# Altium schematic sheet MCU_A.SchDoc
size A3; SheetNumber: 1; SheetTotal: 5
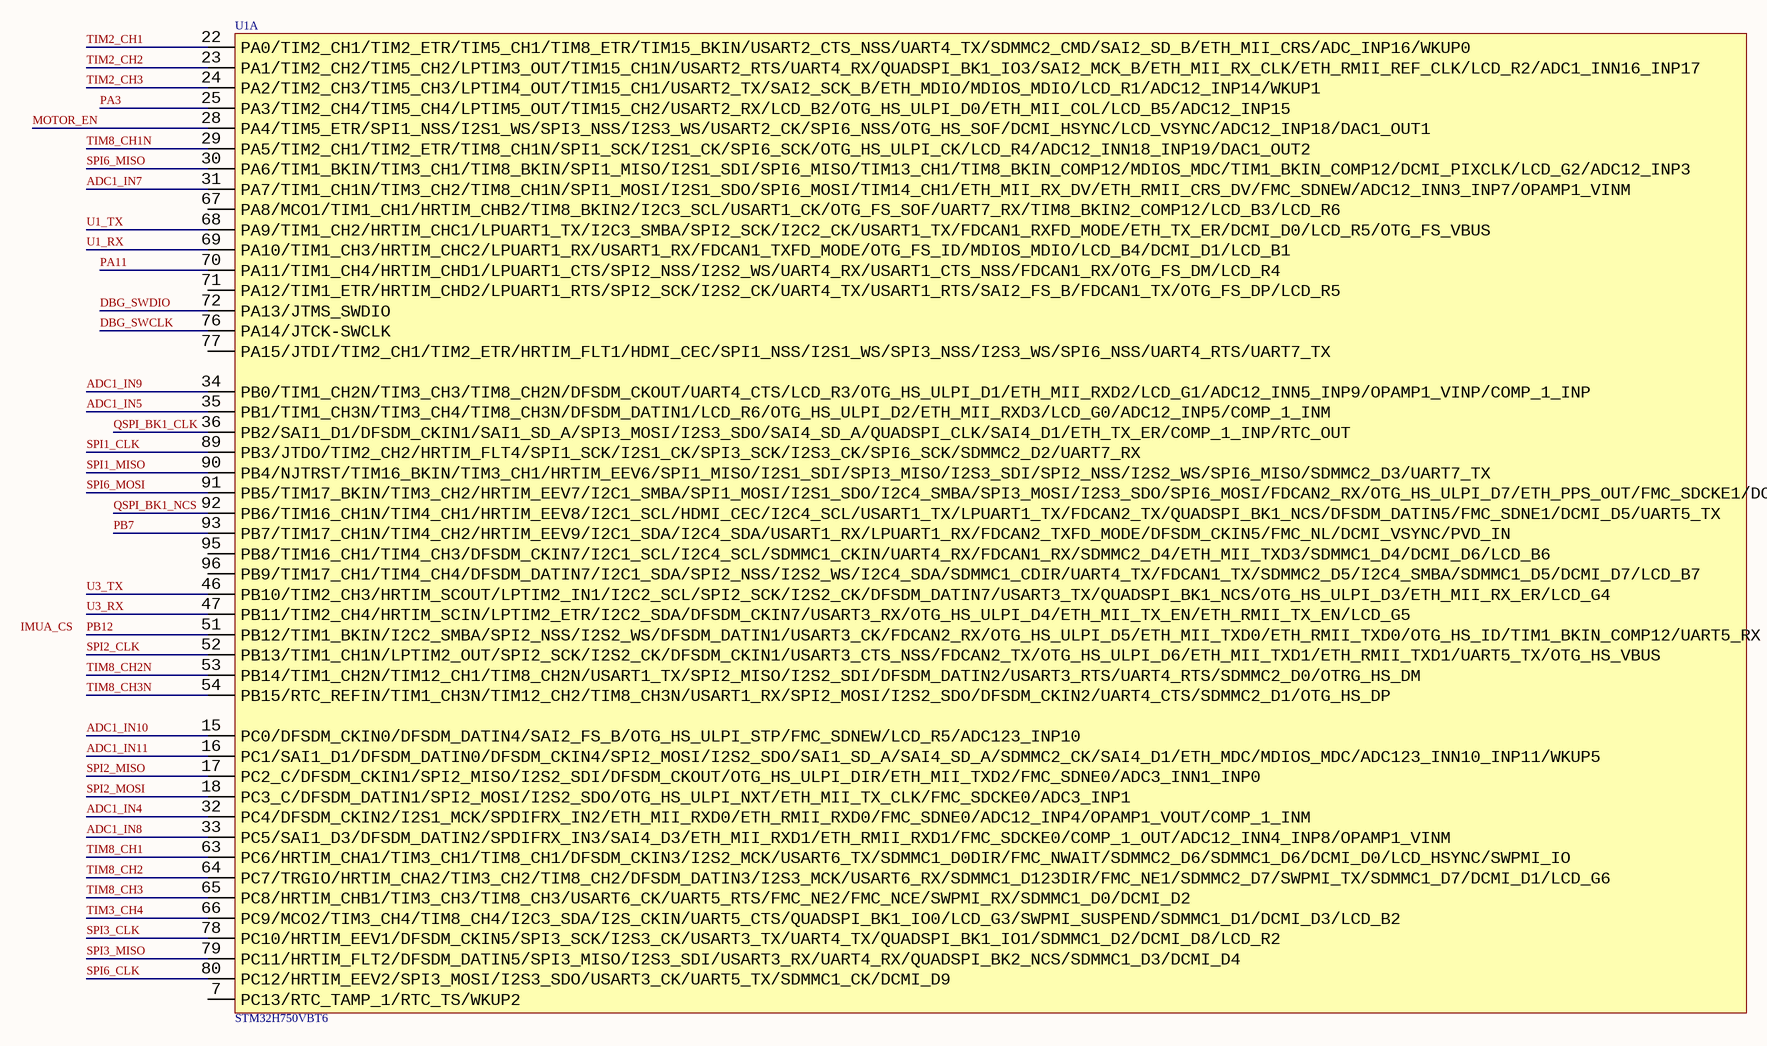
[diagram p0: MCU_A.SchDoc]

## Parts
U1  STM32H750VBT6  [LQFP100 14x14_L]  (part A of 3)

## Nets
ADC1_IN4: U1.32(PC4/DFSDM_CKIN2/I2S1_MCK/SPDIFRX_IN2/ETH_MII_RXD0/ETH_RMII_RXD0/FMC_SDNE0/ADC12_INP4/OPAMP1_VOUT/COMP_1_INM)
ADC1_IN5: U1.35(PB1/TIM1_CH3N/TIM3_CH4/TIM8_CH3N/DFSDM_DATIN1/LCD_R6/OTG_HS_ULPI_D2/ETH_MII_RXD3/LCD_G0/ADC12_INP5/COMP_1_INM)
ADC1_IN7: U1.31(PA7/TIM1_CH1N/TIM3_CH2/TIM8_CH1N/SPI1_MOSI/I2S1_SDO/SPI6_MOSI/TIM14_CH1/ETH_MII_RX_DV/ETH_RMII_CRS_DV/FMC_SDNEW/ADC12_INN3_INP7/OPAMP1_VINM)
ADC1_IN8: U1.33(PC5/SAI1_D3/DFSDM_DATIN2/SPDIFRX_IN3/SAI4_D3/ETH_MII_RXD1/ETH_RMII_RXD1/FMC_SDCKE0/COMP_1_OUT/ADC12_INN4_INP8/OPAMP1_VINM)
ADC1_IN9: U1.34(PB0/TIM1_CH2N/TIM3_CH3/TIM8_CH2N/DFSDM_CKOUT/UART4_CTS/LCD_R3/OTG_HS_ULPI_D1/ETH_MII_RXD2/LCD_G1/ADC12_INN5_INP9/OPAMP1_VINP/COMP_1_INP)
ADC1_IN10: U1.15(PC0/DFSDM_CKIN0/DFSDM_DATIN4/SAI2_FS_B/OTG_HS_ULPI_STP/FMC_SDNEW/LCD_R5/ADC123_INP10)
ADC1_IN11: U1.16(PC1/SAI1_D1/DFSDM_DATIN0/DFSDM_CKIN4/SPI2_MOSI/I2S2_SDO/SAI1_SD_A/SAI4_SD_A/SDMMC2_CK/SAI4_D1/ETH_MDC/MDIOS_MDC/ADC123_INN10_INP11/WKUP5)
DBG_SWCLK: U1.76(PA14/JTCK-SWCLK)
DBG_SWDIO: U1.72(PA13/JTMS_SWDIO)
MOTOR_EN: U1.28(PA4/TIM5_ETR/SPI1_NSS/I2S1_WS/SPI3_NSS/I2S3_WS/USART2_CK/SPI6_NSS/OTG_HS_SOF/DCMI_HSYNC/LCD_VSYNC/ADC12_INP18/DAC1_OUT1)
PA3: U1.25(PA3/TIM2_CH4/TIM5_CH4/LPTIM5_OUT/TIM15_CH2/USART2_RX/LCD_B2/OTG_HS_ULPI_D0/ETH_MII_COL/LCD_B5/ADC12_INP15)
PA11: U1.70(PA11/TIM1_CH4/HRTIM_CHD1/LPUART1_CTS/SPI2_NSS/I2S2_WS/UART4_RX/USART1_CTS_NSS/FDCAN1_RX/OTG_FS_DM/LCD_R4)
PB7: U1.93(PB7/TIM17_CH1N/TIM4_CH2/HRTIM_EEV9/I2C1_SDA/I2C4_SDA/USART1_RX/LPUART1_RX/FDCAN2_TXFD_MODE/DFSDM_CKIN5/FMC_NL/DCMI_VSYNC/PVD_IN)
PB12: U1.51(PB12/TIM1_BKIN/I2C2_SMBA/SPI2_NSS/I2S2_WS/DFSDM_DATIN1/USART3_CK/FDCAN2_RX/OTG_HS_ULPI_D5/ETH_MII_TXD0/ETH_RMII_TXD0/OTG_HS_ID/TIM1_BKIN_COMP12/UART5_RX)
QSPI_BK1_CLK: U1.36(PB2/SAI1_D1/DFSDM_CKIN1/SAI1_SD_A/SPI3_MOSI/I2S3_SDO/SAI4_SD_A/QUADSPI_CLK/SAI4_D1/ETH_TX_ER/COMP_1_INP/RTC_OUT)
QSPI_BK1_NCS: U1.92(PB6/TIM16_CH1N/TIM4_CH1/HRTIM_EEV8/I2C1_SCL/HDMI_CEC/I2C4_SCL/USART1_TX/LPUART1_TX/FDCAN2_TX/QUADSPI_BK1_NCS/DFSDM_DATIN5/FMC_SDNE1/DCMI_D5/UART5_TX)
SPI1_CLK: U1.89(PB3/JTDO/TIM2_CH2/HRTIM_FLT4/SPI1_SCK/I2S1_CK/SPI3_SCK/I2S3_CK/SPI6_SCK/SDMMC2_D2/UART7_RX)
SPI1_MISO: U1.90(PB4/NJTRST/TIM16_BKIN/TIM3_CH1/HRTIM_EEV6/SPI1_MISO/I2S1_SDI/SPI3_MISO/I2S3_SDI/SPI2_NSS/I2S2_WS/SPI6_MISO/SDMMC2_D3/UART7_TX)
SPI2_CLK: U1.52(PB13/TIM1_CH1N/LPTIM2_OUT/SPI2_SCK/I2S2_CK/DFSDM_CKIN1/USART3_CTS_NSS/FDCAN2_TX/OTG_HS_ULPI_D6/ETH_MII_TXD1/ETH_RMII_TXD1/UART5_TX/OTG_HS_VBUS)
SPI2_MISO: U1.17(PC2_C/DFSDM_CKIN1/SPI2_MISO/I2S2_SDI/DFSDM_CKOUT/OTG_HS_ULPI_DIR/ETH_MII_TXD2/FMC_SDNE0/ADC3_INN1_INP0)
SPI2_MOSI: U1.18(PC3_C/DFSDM_DATIN1/SPI2_MOSI/I2S2_SDO/OTG_HS_ULPI_NXT/ETH_MII_TX_CLK/FMC_SDCKE0/ADC3_INP1)
SPI3_CLK: U1.78(PC10/HRTIM_EEV1/DFSDM_CKIN5/SPI3_SCK/I2S3_CK/USART3_TX/UART4_TX/QUADSPI_BK1_IO1/SDMMC1_D2/DCMI_D8/LCD_R2)
SPI3_MISO: U1.79(PC11/HRTIM_FLT2/DFSDM_DATIN5/SPI3_MISO/I2S3_SDI/USART3_RX/UART4_RX/QUADSPI_BK2_NCS/SDMMC1_D3/DCMI_D4)
SPI6_CLK: U1.80(PC12/HRTIM_EEV2/SPI3_MOSI/I2S3_SDO/USART3_CK/UART5_TX/SDMMC1_CK/DCMI_D9)
SPI6_MISO: U1.30(PA6/TIM1_BKIN/TIM3_CH1/TIM8_BKIN/SPI1_MISO/I2S1_SDI/SPI6_MISO/TIM13_CH1/TIM8_BKIN_COMP12/MDIOS_MDC/TIM1_BKIN_COMP12/DCMI_PIXCLK/LCD_G2/ADC12_INP3)
SPI6_MOSI: U1.91(PB5/TIM17_BKIN/TIM3_CH2/HRTIM_EEV7/I2C1_SMBA/SPI1_MOSI/I2S1_SDO/I2C4_SMBA/SPI3_MOSI/I2S3_SDO/SPI6_MOSI/FDCAN2_RX/OTG_HS_ULPI_D7/ETH_PPS_OUT/FMC_SDCKE1/DCMI_D10/UART5_RX)
TIM2_CH1: U1.22(PA0/TIM2_CH1/TIM2_ETR/TIM5_CH1/TIM8_ETR/TIM15_BKIN/USART2_CTS_NSS/UART4_TX/SDMMC2_CMD/SAI2_SD_B/ETH_MII_CRS/ADC_INP16/WKUP0)
TIM2_CH2: U1.23(PA1/TIM2_CH2/TIM5_CH2/LPTIM3_OUT/TIM15_CH1N/USART2_RTS/UART4_RX/QUADSPI_BK1_IO3/SAI2_MCK_B/ETH_MII_RX_CLK/ETH_RMII_REF_CLK/LCD_R2/ADC1_INN16_INP17)
TIM2_CH3: U1.24(PA2/TIM2_CH3/TIM5_CH3/LPTIM4_OUT/TIM15_CH1/USART2_TX/SAI2_SCK_B/ETH_MDIO/MDIOS_MDIO/LCD_R1/ADC12_INP14/WKUP1)
TIM3_CH4: U1.66(PC9/MCO2/TIM3_CH4/TIM8_CH4/I2C3_SDA/I2S_CKIN/UART5_CTS/QUADSPI_BK1_IO0/LCD_G3/SWPMI_SUSPEND/SDMMC1_D1/DCMI_D3/LCD_B2)
TIM8_CH1: U1.63(PC6/HRTIM_CHA1/TIM3_CH1/TIM8_CH1/DFSDM_CKIN3/I2S2_MCK/USART6_TX/SDMMC1_D0DIR/FMC_NWAIT/SDMMC2_D6/SDMMC1_D6/DCMI_D0/LCD_HSYNC/SWPMI_IO)
TIM8_CH1N: U1.29(PA5/TIM2_CH1/TIM2_ETR/TIM8_CH1N/SPI1_SCK/I2S1_CK/SPI6_SCK/OTG_HS_ULPI_CK/LCD_R4/ADC12_INN18_INP19/DAC1_OUT2)
TIM8_CH2: U1.64(PC7/TRGIO/HRTIM_CHA2/TIM3_CH2/TIM8_CH2/DFSDM_DATIN3/I2S3_MCK/USART6_RX/SDMMC1_D123DIR/FMC_NE1/SDMMC2_D7/SWPMI_TX/SDMMC1_D7/DCMI_D1/LCD_G6)
TIM8_CH2N: U1.53(PB14/TIM1_CH2N/TIM12_CH1/TIM8_CH2N/USART1_TX/SPI2_MISO/I2S2_SDI/DFSDM_DATIN2/USART3_RTS/UART4_RTS/SDMMC2_D0/OTRG_HS_DM)
TIM8_CH3: U1.65(PC8/HRTIM_CHB1/TIM3_CH3/TIM8_CH3/USART6_CK/UART5_RTS/FMC_NE2/FMC_NCE/SWPMI_RX/SDMMC1_D0/DCMI_D2)
TIM8_CH3N: U1.54(PB15/RTC_REFIN/TIM1_CH3N/TIM12_CH2/TIM8_CH3N/USART1_RX/SPI2_MOSI/I2S2_SDO/DFSDM_CKIN2/UART4_CTS/SDMMC2_D1/OTG_HS_DP)
U1_RX: U1.69(PA10/TIM1_CH3/HRTIM_CHC2/LPUART1_RX/USART1_RX/FDCAN1_TXFD_MODE/OTG_FS_ID/MDIOS_MDIO/LCD_B4/DCMI_D1/LCD_B1)
U1_TX: U1.68(PA9/TIM1_CH2/HRTIM_CHC1/LPUART1_TX/I2C3_SMBA/SPI2_SCK/I2C2_CK/USART1_TX/FDCAN1_RXFD_MODE/ETH_TX_ER/DCMI_D0/LCD_R5/OTG_FS_VBUS)
U3_RX: U1.47(PB11/TIM2_CH4/HRTIM_SCIN/LPTIM2_ETR/I2C2_SDA/DFSDM_CKIN7/USART3_RX/OTG_HS_ULPI_D4/ETH_MII_TX_EN/ETH_RMII_TX_EN/LCD_G5)
U3_TX: U1.46(PB10/TIM2_CH3/HRTIM_SCOUT/LPTIM2_IN1/I2C2_SCL/SPI2_SCK/I2S2_CK/DFSDM_DATIN7/USART3_TX/QUADSPI_BK1_NCS/OTG_HS_ULPI_D3/ETH_MII_RX_ER/LCD_G4)

Not connected (* = marked no-connect by the designer): U1 7(PC13/RTC_TAMP_1/RTC_TS/WKUP2) 67(PA8/MCO1/TIM1_CH1/HRTIM_CHB2/TIM8_BKIN2/I2C3_SCL/USART1_CK/OTG_FS_SOF/UART7_RX/TIM8_BKIN2_COMP12/LCD_B3/LCD_R6) 71(PA12/TIM1_ETR/HRTIM_CHD2/LPUART1_RTS/SPI2_SCK/I2S2_CK/UART4_TX/USART1_RTS/SAI2_FS_B/FDCAN1_TX/OTG_FS_DP/LCD_R5) 77(PA15/JTDI/TIM2_CH1/TIM2_ETR/HRTIM_FLT1/HDMI_CEC/SPI1_NSS/I2S1_WS/SPI3_NSS/I2S3_WS/SPI6_NSS/UART4_RTS/UART7_TX) 95(PB8/TIM16_CH1/TIM4_CH3/DFSDM_CKIN7/I2C1_SCL/I2C4_SCL/SDMMC1_CKIN/UART4_RX/FDCAN1_RX/SDMMC2_D4/ETH_MII_TXD3/SDMMC1_D4/DCMI_D6/LCD_B6) 96(PB9/TIM17_CH1/TIM4_CH4/DFSDM_DATIN7/I2C1_SDA/SPI2_NSS/I2S2_WS/I2C4_SDA/SDMMC1_CDIR/UART4_TX/FDCAN1_TX/SDMMC2_D5/I2C4_SMBA/SDMMC1_D5/DCMI_D7/LCD_B7)

## Notes on the sheet
- IMUA_CS